# EAGLE design YaskawaSpeedControl (EAGLE 7.6.0)
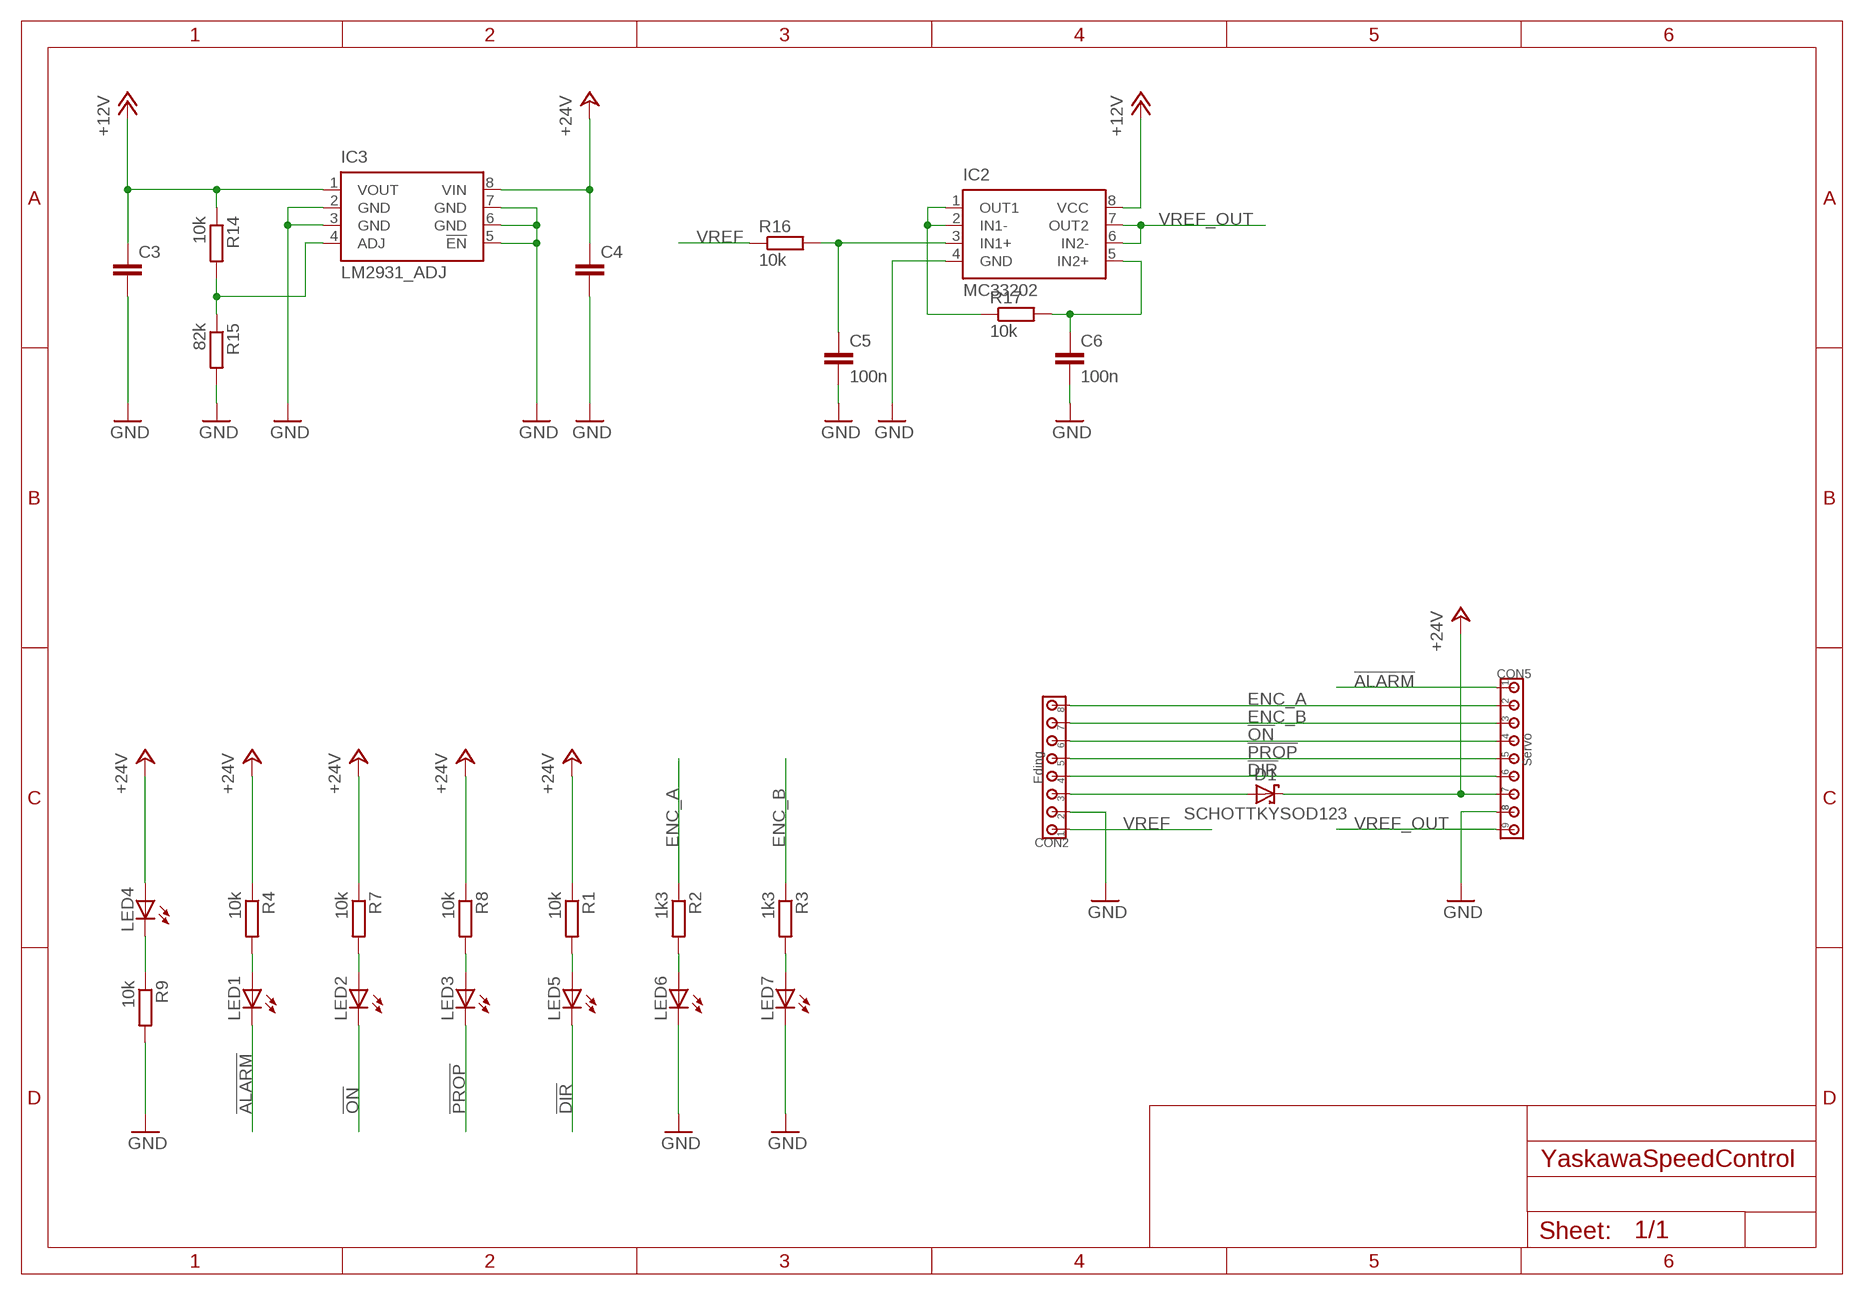
[diagram p0: schematic, sheet 1]

## Parts
C3  CC1206  [C1206]
C4  CC1206  [C1206]
C5  100n  CC0805  [C0805]
C6  100n  CC0805  [C0805]
CON2  Eding  CON_8X3.5MM  [3.5MM_8X]
CON5  Servo  CON_9X3.5MM  [3.5MM_9X]
D1  SCHOTTKYSOD123  [SOD123]
IC2  MC33202  [SOIC8]
IC3  LM2931_ADJ  [SOIC8]
LED1  LED0805  [LED0805]
LED2  LED0805  [LED0805]
LED3  LED0805  [LED0805]
LED4  LED0805  [LED0805]
LED5  LED0805  [LED0805]
LED6  LED0805  [LED0805]
LED7  LED0805  [LED0805]
R1  10k  RESISTORR0805  [R0805]
R2  1k3  RESISTORR0805  [R0805]
R3  1k3  RESISTORR0805  [R0805]
R4  10k  RESISTORR0805  [R0805]
R7  10k  RESISTORR0805  [R0805]
R8  10k  RESISTORR0805  [R0805]
R9  10k  RESISTORR0805  [R0805]
R14  10k  RESISTORR0805  [R0805]
R15  82k  RESISTORR0805  [R0805]
R16  10k  RESISTORR0805  [R0805]
R17  10k  RESISTORR0805  [R0805]

## Nets
!ALARM!: CON5.1 LED1.C
!DIR!: CON2.4 CON5.6 LED5.C
!ON!: CON2.6 CON5.4 LED2.C
!PROP!: CON2.5 CON5.5 LED3.C
+12V: C3.1 IC2.8(VCC) IC3.1(VOUT) R14.1
+24V: C4.1 CON5.7 D1.C IC3.8(VIN) LED4.A R1.1 R4.1 R7.1 R8.1
ENC_A: CON2.8 CON5.2 R2.1
ENC_B: CON2.7 CON5.3 R3.1
GND: C3.2 C4.2 C5.2 C6.2 CON2.2 CON5.8 IC2.4(GND) IC3.2(GND) IC3.3(GND) IC3.5(!EN!) IC3.6(GND) IC3.7(GND) LED6.C LED7.C R9.2 R15.2
N$1: LED5.A R1.2
N$2: LED1.A R4.2
N$4: LED2.A R7.2
N$5: LED3.A R8.2
N$6: LED4.C R9.1
N$8: LED6.A R2.2
N$11: LED7.A R3.2
N$12: IC3.4(ADJ) R14.2 R15.1
N$13: CON2.3 D1.A
N$14: IC2.1(OUT1) IC2.2(IN1-) R17.1
N$15: C5.1 IC2.3(IN1+) R16.2
N$19: C6.1 IC2.5(IN2+) R17.2
VREF: CON2.1 R16.1
VREF_OUT: CON5.9 IC2.6(IN2-) IC2.7(OUT2)

## Library data of the parts
C3-C6 = 00Capacitor:C: Capacitor
CON2 = 00Connector:CON_8X: 8-pin header
CON5 = 00Connector:CON_9X: 9-pin header
D1 = 00Diode:SCHOTTKY
IC2 = 00OpAmp:MC33202: Dual Rail-to-Rail Op Amp 1.8 - 12V
IC3 = 00VoltageRegulator:LM2931_ADJ
LED1-LED7 = 00Display:LED: LED
R1-R4 R7-R9 R14-R17 = 00Resistor:RESISTOR: RESISTOR, European symbol

## Net classes
1 24V: clearance 0.305 mm

## Board
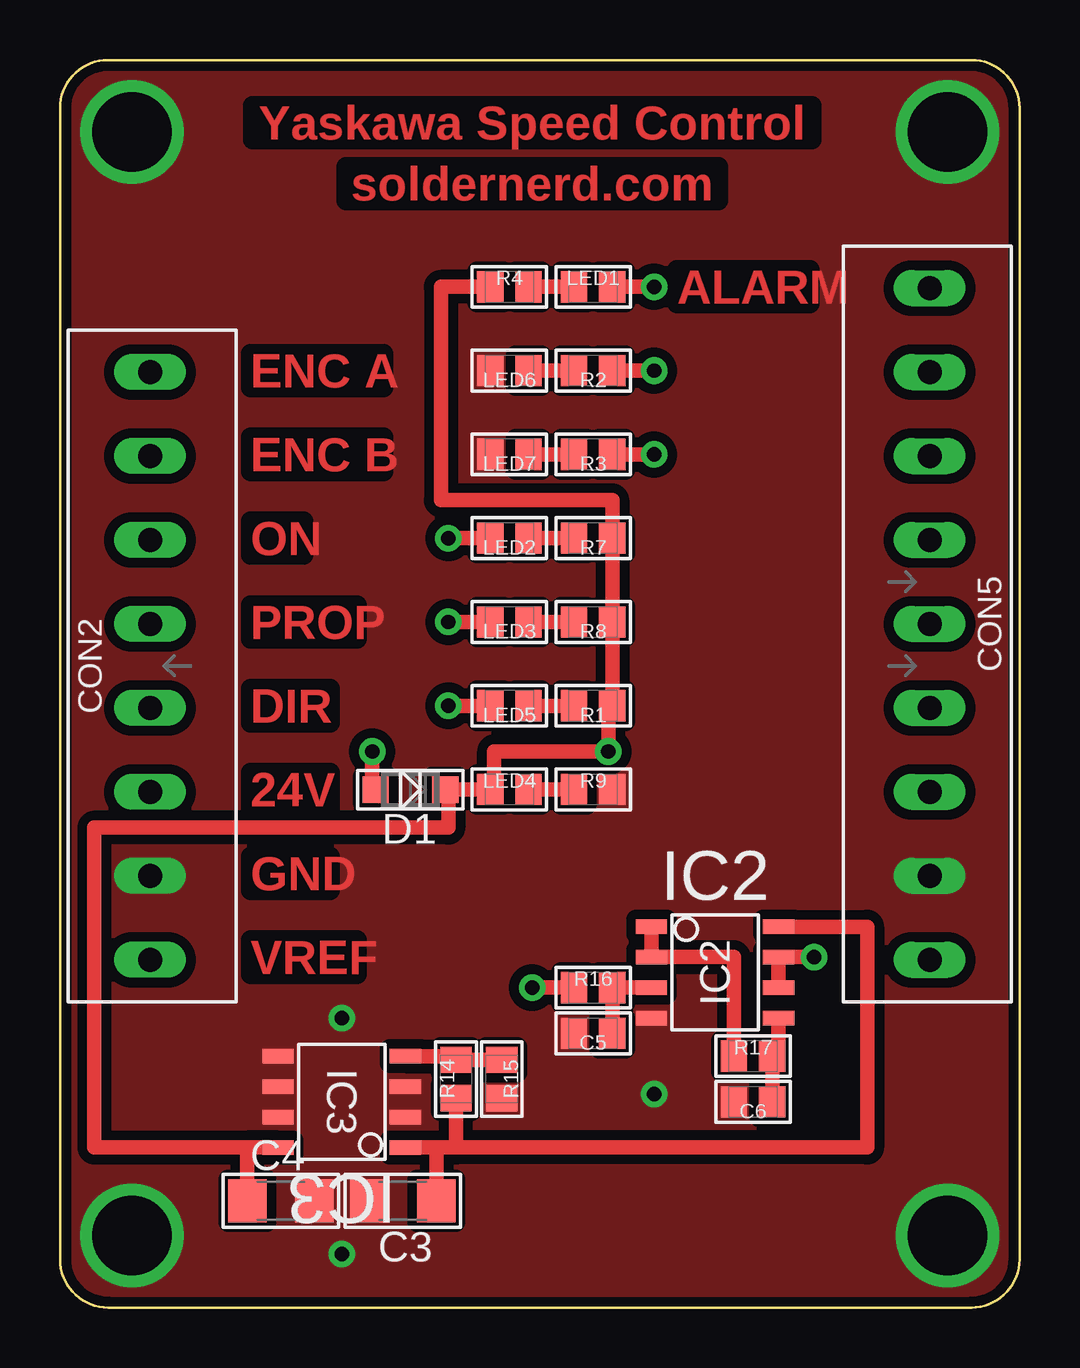
[diagram p1: board, top side]
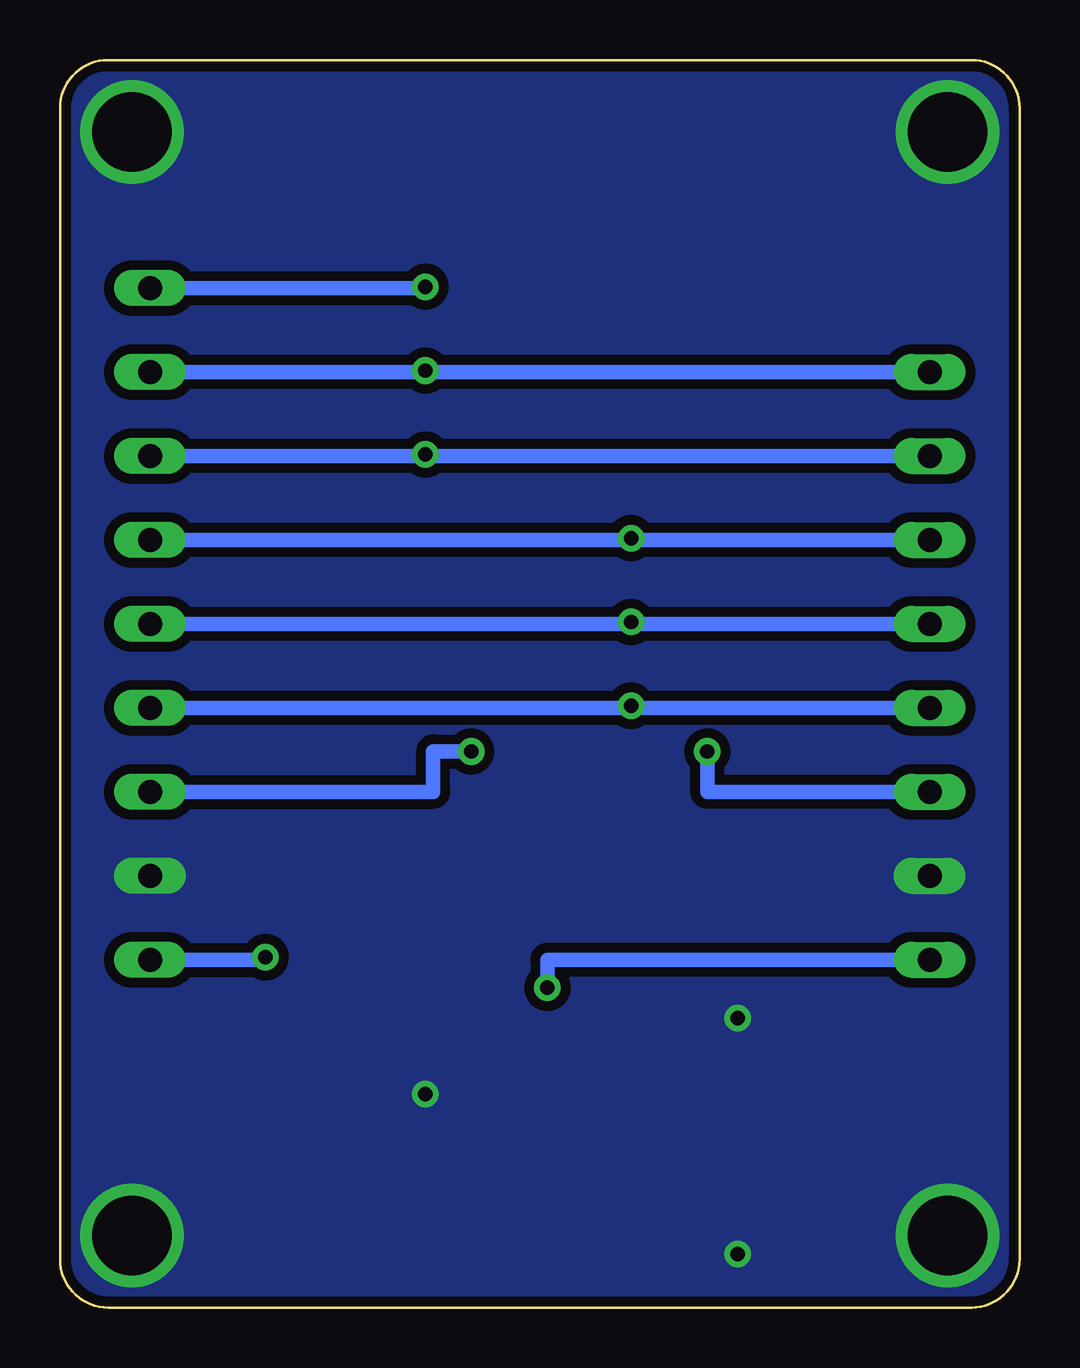
[diagram p2: board, bottom side, seen from below]

Size 40 x 52 mm. Coordinates in mm from the lower left corner, seen from the top.
Outline: 38,0 arc90 40,2 40,50 arc90 38,52 2,52 arc90 0,50 0,2 arc90 2,0 38,0
Copper layers (1*16): Top 0.035mm / dielectric 1.5mm / Bottom 0.035mm
Design rules "LPKF_Compatible": minimum track width 8mil, minimum drill 23mil, track to track 8mil, track to pad 8mil, pad to pad 8mil, via to via 8mil, smd to smd 0mil, copper to edge 10mil, drill to drill 10mil, minimum pad ring 10mil, minimum via ring 10mil, stop-mask expansion 2mil, vias tented up to drill 25mil, thermal gap 10mil

### Footprints (pad centres in the part's own frame; a part is rotated, then mirrored left to right if it is on the bottom)
C1206 = smd 1.6 x 1.8: 1 -1.4,0; 2 1.4,0
C0805 = smd 1.1 x 1.3: 1 -0.8,0; 2 0.8,0
3.5MM_8X = drill 1 long: 1 -12.25,0; 2 -8.75,0; 3 -5.25,0; 4 -1.75,0; 5 1.75,0; 6 5.25,0; 7 8.75,0; 8 12.25,0
3.5MM_9X = drill 1 long: 1 -14,0; 2 -10.5,0; 3 -7,0; 4 -3.5,0; 5 0,0; 6 3.5,0; 7 7,0; 8 10.5,0; 9 14,0
SOD123 = smd 1.1 x 1.1: A 1.45,0; C -1.45,0
SOIC8 = smd 1.3 x 0.6: 1 -2.65,1.905; 2 -2.65,0.635; 3 -2.65,-0.635; 4 -2.65,-1.905; 5 2.65,-1.905; 6 2.65,-0.635; 7 2.65,0.635; 8 2.65,1.905
LED0805 = smd 1.1 x 1.3: A -0.8,0; C 0.8,0
R0805 = smd 1.1 x 1.3: 1 -0.8,0; 2 0.8,0

### Placement (x,y rotation side)
C3  14.29,4.45 180 top
C4  9.21,4.45 0 top
C5  22.23,11.43 180 top
C6  28.89,8.57 180 top
CON2  3.75,26.75 90 top
CON5  36.25,28.5 270 top
D1  14.61,21.59 180 top
IC2  27.3,13.97 0 top
IC3  11.75,8.57 180 top
LED1  22.23,42.55 0 top
LED2  18.73,32.07 180 top
LED3  18.73,28.57 180 top
LED4  18.73,21.59 0 top
LED5  18.73,25.08 180 top
LED6  18.73,39.05 180 top
LED7  18.73,35.56 180 top
R1  22.23,25.08 180 top
R2  22.23,39.05 180 top
R3  22.23,35.56 180 top
R4  18.73,42.55 0 top
R7  22.23,32.07 180 top
R8  22.23,28.57 180 top
R9  22.23,21.59 0 top
R14  16.51,9.53 90 top
R15  18.41,9.53 270 top
R16  22.23,13.34 0 top
R17  28.89,10.48 0 top

### Tracks (layer width: path | path; a pad name or v marks a point on that pad's centre or on a via)
!ALARM!  (via drill 0.6)
  Top 0.61: LED1.C v24.77,42.55
  Bottom 0.61: CON5.1 24.77,42.5 v24.77,42.55
!DIR!  (via drill 0.6)
  Top 0.61: LED5.C v16.19,25.08
  Bottom 0.61: CON2.4 16.19,25 | 16.19,25 CON5.6 | v16.19,25.08 16.19,25
!ON!  (via drill 0.6)
  Top 0.61: LED2.C v16.19,32.07
  Bottom 0.61: CON2.6 16.19,32 | 16.19,32 CON5.4 | v16.19,32.07 16.19,32
!PROP!  (via drill 0.6)
  Top 0.61: LED3.C v16.19,28.57 16.19,28.5
  Bottom 0.61: CON2.5 16.19,28.5 | 16.19,28.5 CON5.5 | v16.19,28.57 16.19,28.5
+12V
  Top 0.61: IC3.1 15.69,6.67 | 15.69,6.67 C3.1 | 15.69,6.67 16.51,6.67 | 16.51,6.67 R14.1 | IC2.8 33.66,15.88 33.66,6.67 16.51,6.67
+24V  (via drill 0.6)
  Top 0.61: R4.1 15.88,42.55 15.88,33.66 23.02,33.66 R7.1 R8.1 R1.1 22.86,25.08 v22.86,23.18 18.1,23.18 18.1,21.59 LED4.A D1.C 16.19,21.59 16.19,20 1.43,20 1.43,6.67 7.81,6.67 | IC3.8 7.81,6.67 | 7.81,6.67 C4.1
  Bottom 0.61: CON5.7 24.45,21.5 24.45,23.18 v22.86,23.18
ENC_A  (via drill 0.6)
  Top 0.61: R2.1 v24.77,39.05
  Bottom 0.61: CON2.8 24.77,39 | 24.77,39 CON5.2 | v24.77,39.05 24.77,39
ENC_B  (via drill 0.6)
  Top 0.61: R3.1 v24.77,35.56
  Bottom 0.61: CON2.7 24.77,35.5 | 24.77,35.5 CON5.3 | v24.77,35.56 24.77,35.5
GND  (via drill 0.6, 3.3)
  other vias: 3,49 37,49 37,3 3,3 24.77,8.89 11.75,12.06 11.75,2.22
  pour Bottom (isolate 0.406, rank 3, no thermals): 38,0 2,0 arc-90 0,2 0,50 arc-90 2,52 38,52 arc-90 40,50 40,2 arc-90
  pour Top (isolate 0.406, rank 3, no thermals): 0,2 0,50 arc-90 2,52 38,52 arc-90 40,50 40,2 arc-90 38,0 2,0 arc-90
N$1
  Top 0.61: R1.2 LED5.A
N$2
  Top 0.61: R4.2 LED1.A
N$4
  Top 0.61: R7.2 LED2.A
N$5
  Top 0.61: LED3.A R8.2
N$6
  Top 0.61: LED4.C R9.1
N$8
  Top 0.61: R2.2 LED6.A
N$11
  Top 0.61: LED7.A R3.2
N$12
  Top 0.61: R15.1 R14.2 16.51,10.48 IC3.4
N$13  (via drill 0.6)
  Top 0.61: D1.A 13.02,21.59 v13.02,23.18
  Bottom 0.61: CON2.3 13.02,21.5 v13.02,23.18
N$14
  Top 0.61: IC2.1 IC2.2 28.09,14.61 R17.1
N$15
  Top 0.61: IC2.3 R16.2 C5.1
N$19
  Top 0.61: C6.1 R17.2 29.95,10.48 IC2.5
VREF  (via drill 0.6)
  Top 0.61: R16.1 v19.68,13.34
  Bottom 0.61: CON2.1 19.68,14.5 v19.68,13.34
VREF_OUT  (via drill 0.6)
  Top 0.61: IC2.6 IC2.7 v31.43,14.61
  Bottom 0.61: CON5.9 31.43,14.5 v31.43,14.61

### Text on the board
Top: Yaskawa Speed Control | soldernerd.com | ALARM | ENC A | ENC B | ON | PROP | DIR | 24V | GND | VREF